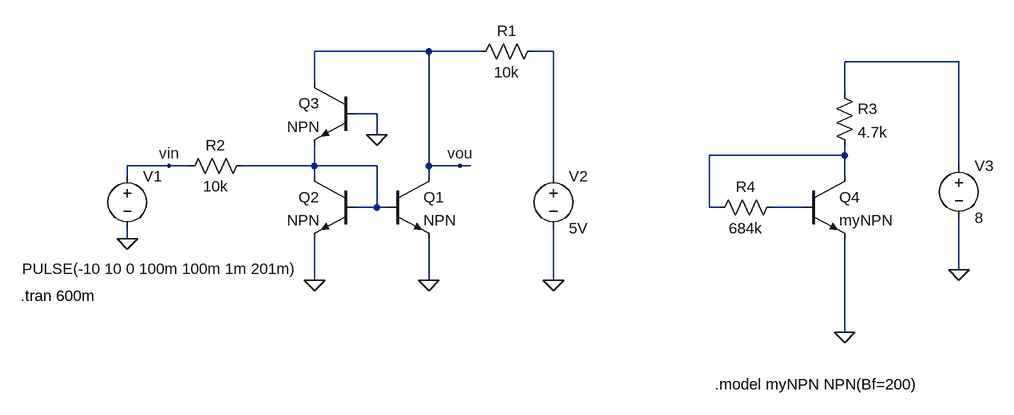
[diagram p0: schematic SS2012_A.asc]
SS2012_A.asc, the LTspice schematic file:
Version 4
SHEET 1 1260 680
WIRE 368 -32 192 -32
WIRE 448 -32 368 -32
WIRE 560 -32 528 -32
WIRE 1184 -16 1008 -16
WIRE 192 16 192 -32
WIRE 1008 32 1008 -16
WIRE 288 64 256 64
WIRE 288 96 288 64
WIRE 1008 128 1008 112
WIRE 1008 128 800 128
WIRE -32 144 -96 144
WIRE 0 144 -32 144
WIRE 192 144 192 112
WIRE 192 144 80 144
WIRE 288 144 192 144
WIRE 368 144 368 -32
WIRE 416 144 368 144
WIRE 432 144 416 144
WIRE 1184 144 1184 -16
WIRE -96 160 -96 144
WIRE 192 160 192 144
WIRE 368 160 368 144
WIRE 560 160 560 -32
WIRE 1008 160 1008 128
WIRE 288 208 288 144
WIRE 288 208 256 208
WIRE 304 208 288 208
WIRE 800 208 800 128
WIRE 816 208 800 208
WIRE 944 208 896 208
WIRE -96 256 -96 240
WIRE 1184 304 1184 224
WIRE 192 320 192 256
WIRE 368 320 368 256
WIRE 560 320 560 240
WIRE 1008 400 1008 256
FLAG 288 96 0
FLAG 192 320 0
FLAG 368 320 0
FLAG -96 256 0
FLAG 560 320 0
FLAG 416 144 vou
FLAG -32 144 vin
FLAG 1184 304 0
FLAG 1008 400 0
SYMBOL voltage -96 144 R0
WINDOW 3 -162 158 Left 2
WINDOW 123 0 0 Left 2
WINDOW 39 0 0 Left 2
SYMATTR InstName V1
SYMATTR Value PULSE(-10 10 0 100m 100m 1m 201m)
SYMBOL npn 304 160 R0
SYMATTR InstName Q1
SYMBOL npn 256 160 M0
SYMATTR InstName Q2
SYMBOL npn 256 16 M0
SYMATTR InstName Q3
SYMBOL voltage 560 144 R0
WINDOW 123 0 0 Left 2
WINDOW 39 0 0 Left 2
SYMATTR InstName V2
SYMATTR Value 5V
SYMBOL res 544 -48 R90
WINDOW 0 0 56 VBottom 2
WINDOW 3 32 56 VTop 2
SYMATTR InstName R1
SYMATTR Value 10k
SYMBOL res 96 128 R90
WINDOW 0 0 56 VBottom 2
WINDOW 3 32 56 VTop 2
SYMATTR InstName R2
SYMATTR Value 10k
SYMBOL npn 944 160 R0
SYMATTR InstName Q4
SYMATTR Value myNPN
SYMBOL voltage 1184 128 R0
WINDOW 123 0 0 Left 2
WINDOW 39 0 0 Left 2
SYMATTR InstName V3
SYMATTR Value 8
SYMBOL res 992 16 R0
SYMATTR InstName R3
SYMATTR Value 4.7k
SYMBOL res 912 192 R90
WINDOW 0 0 56 VBottom 2
WINDOW 3 32 56 VTop 2
SYMATTR InstName R4
SYMATTR Value 684k
TEXT -260 344 Left 2 !.tran 600m
TEXT 808 480 Left 2 !.model myNPN NPN(Bf=200)

The netlist it stands for:
* SS2012_A.asc
V1 vin 0 PULSE(-10 10 0 100m 100m 1m 201m)
Q1 vou N004 0 0 NPN
Q2 N004 N004 0 0 NPN
Q3 vou 0 N004 0 NPN
V2 N001 0 5V
R1 N001 vou 10k
R2 N004 vin 10k
Q4 N003 N005 0 0 myNPN
V3 N002 0 8
R3 N002 N003 4.7k
R4 N005 N003 684k
.model NPN NPN
.model PNP PNP
.lib standard.bjt
.tran 600m
.model myNPN NPN(Bf=200)
.backanno
.end